# EasyEDA Pro project Thomas' USB Hub.epro

# Schematic Schematic1
Board Name: Board1; Create Date: 2026-05-09; Page Name: P1; Project Name: USB hub; Schematic Name: Schematic1; Update Date: 2026-05-09; Company: EasyEDA.com; Page Size: A4; Version: V1.0
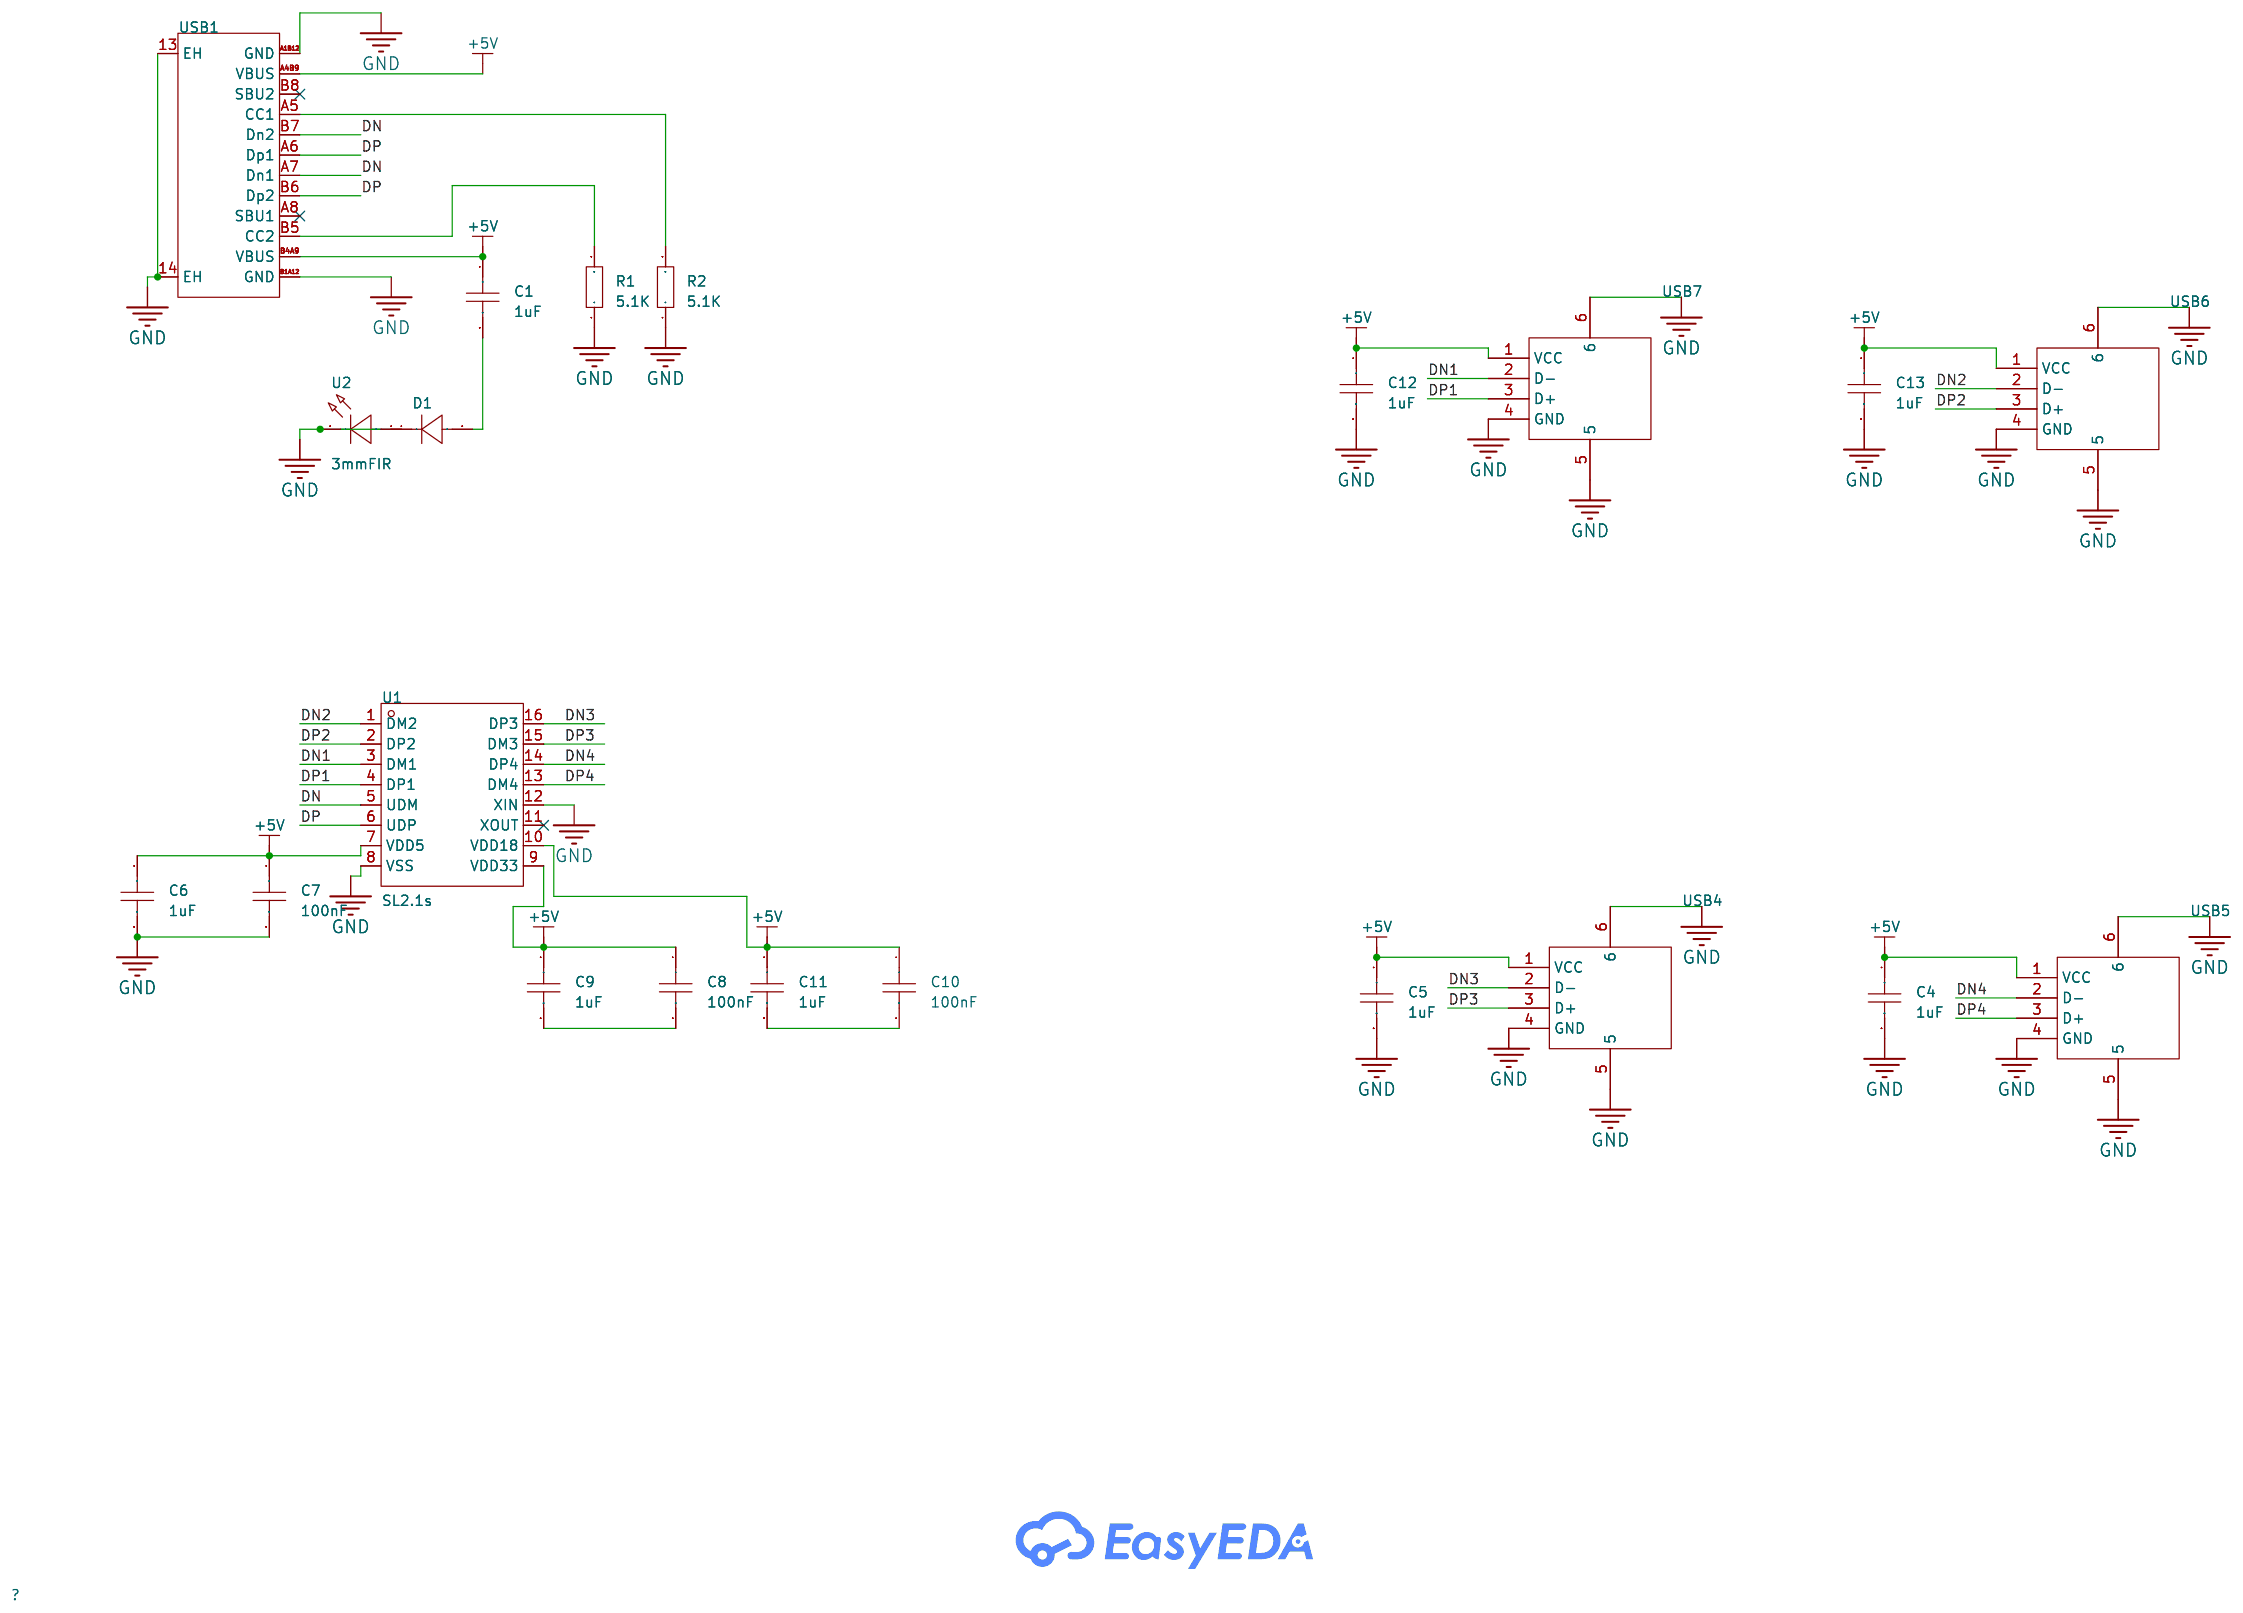
[diagram p0: schematic sheet]

## Parts
C1  1uF  [C0603]
C4  1uF  [C0603]
C5  1uF  [C0603]
C6  1uF  [C0603]
C7  1uF  [C0603]
C8  100nF  [C0603]
C9  1uF  [C0603]
C10  1uF  [C0603]
C11  1uF  [C0603]
C12  1uF  [C0603]
C13  1uF  [C0603]
D1  -  [SMA_L4.4-W2.8-LS5.4-RD]
R1  10K  [R0603]
R2  10K  [R0603]
U1  SL2.1s  [SSOP-16_L4.6-W2.6-P0.53-LS4.0-BL]
U2  3mmFIR  [LED-TH_BD3.0-P2.54-FD]
USB1  TYPE-C 16PIN 2MD(073)  [USB-C-SMD_TYPE-C-16PIN-2MD-073]
USB4  10.0 QHHTZB6.3  [USB-A-TH_10.0QHHTZB6.3]
USB5  10.0 QHHTZB6.3  [USB-A-TH_10.0QHHTZB6.3]
USB6  10.0 QHHTZB6.3  [USB-A-TH_10.0QHHTZB6.3]
USB7  10.0 QHHTZB6.3  [USB-A-TH_10.0QHHTZB6.3]

## Library data of the parts
C1 C4-C13 = CAP_0603: Supplier Footprint: 0603
D1 = 1N4007: Supplier Footprint: SMA(DO-214AC); Supplier Part: C727081
R1 R2 = Res_0603: Supplier Footprint: 0603
U1 = SL2.1s: type:Hub USB Protocol:USB 2.0 Data Rate:- Voltage - Supply:4V~5.25V Voltage - Supply:4V~5.25V Operating Temperature:0℃~+70℃ Operating Temperature:0℃~+70℃ Memory Interface:- Current - Supply:120mA Quiescent Supply Current:2.5mA Number of Channels:4; LCSC Part Name: USB2.0 HUB控制器集成电路; Supplier Part: C2684433; Manufacturer: CoreChips(和芯润德); Supplier Footprint: SSOP-16; JLCPCB Part Class: Extended Part; Datasheet: https://item.szlcsc.com/datasheet/SL2.1s/2782346.html; Supplier: LCSC; type: Hub; USB Protocol: USB 2.0; Voltage - Supply: 4V~5.25V; Operating Temperature: 0℃~+70℃; Current - Supply: 120mA; Quiescent Supply Current: 2.5mA; Number of Channels: 4
U2 = 3mmFIR: Supplier Part: C9900095018; Supplier Footprint: LED-TH_LED-3MM_RED; JLCPCB Part Class: Extended Part; Supplier: LCSC
USB1 = TYPE-C 16PIN 2MD(073): Connector Type:Type-C Protocol Standard:- Gender:Female Mounting Type:Surface Mount, Right Angle Number of Contacts:16P Number of Ports:1 Current Rating-Power:3A Voltage Rating:5V Connect-Disconnect Life:10,000 Cycles Supplementary Features:- Center Heigh; LCSC Part Name: Type-C 母 卧贴; Supplier Part: C2765186; Manufacturer: SHOU HAN(首韩); Supplier Footprint: SMD; JLCPCB Part Class: Extended Part; Datasheet: https://item.szlcsc.com/datasheet/TYPE-C%252016PIN%25202MD(073)/2901843.html; Supplier: LCSC; Connector Type: Type-C; Gender: Female; Mounting Type: Surface Mount, Right Angle; Number of Contacts: 16P; Number of Ports: 1; Current Rating-Power: 3A; Voltage Rating: 5V; Connect-Disconnect Life: 10,000 Cycles; Detection color: Black; Operating Temperature: -25℃~+85℃
USB4-USB7 = 10.0 QHHTZB6.3: Connector Type:Type-A Protocol Standard:USB 2.0 Gender:Female Mounting Type:Surface Mount, Right Angle Number of Contacts:4P Number of Ports:1 Current Rating-Power:1.5A Voltage Rating:30V Connect-Disconnect Life:5,000 times Supplementary Features:- Center; LCSC Part Name: 壳长10.0mm; Supplier Part: C668591; Manufacturer: SHOU HAN(首韩); Supplier Footprint: SMD; JLCPCB Part Class: Extended Part; Datasheet: https://item.szlcsc.com/datasheet/10.0%2520QHHTZB6.3/698534.html; Supplier: LCSC; Connector Type: Type-A; Protocol Standard: USB 2.0; Gender: Female; Mounting Type: Surface Mount, Right Angle; Number of Contacts: 4P; Number of Ports: 1; Current Rating-Power: 1.5A; Voltage Rating: 30V; Connect-Disconnect Life: 5,000 times; Length: 10mm; Detection color: Black; Operating Temperature: -25℃~+85℃

## Nets
+5V: C1.1 C4.1 C5.1 C6.1 C7.1 C8.1 C9.1 C10.1 C11.1 C12.1 C13.1 U1.7(VDD5) U1.9(VDD33) U1.10(VDD18) USB1.A4B9(VBUS) USB1.B4A9(VBUS) USB4.1(VCC) USB5.1(VCC) USB6.1(VCC) USB7.1(VCC)
GND: C4.2 C5.2 C6.2 C7.2 C12.2 C13.2 D1.1(K) R1.1 R2.1 U1.8(VSS) U1.12(XIN) U2.2(K) USB1.13(EH) USB1.14(EH) USB1.A1B12(GND) USB1.B1A12(GND) USB4.4(GND) USB4.5 USB4.6 USB5.4(GND) USB5.5 USB5.6 USB6.4(GND) USB6.5 USB6.6 USB7.4(GND) USB7.5 USB7.6
DN: U1.5(UDM) USB1.A7(Dn1) USB1.B7(Dn2)
DN1: U1.3(DM1) USB7.2(D-)
DN2: U1.1(DM2) USB6.2(D-)
DN3: U1.16(DP3) USB4.2(D-)
DN4: U1.14(DP4) USB5.2(D-)
DP: U1.6(UDP) USB1.A6(Dp1) USB1.B6(Dp2)
DP1: U1.4(DP1) USB7.3(D+)
DP2: U1.2(DP2) USB6.3(D+)
DP3: U1.15(DM3) USB4.3(D+)
DP4: U1.13(DM4) USB5.3(D+)
$1N3638: R2.2 USB1.A5(CC1)
$1N3643: R1.2 USB1.B5(CC2)
$1N4842: C8.2 C9.2
$1N4933: C10.2 C11.2
$1N6861: C1.2 D1.2(A)

Not connected (* = marked no-connect by the designer): U1 11(XOUT)*; U2 1(A); USB1 A8(SBU1)* B8(SBU2)*

# Board PCB1
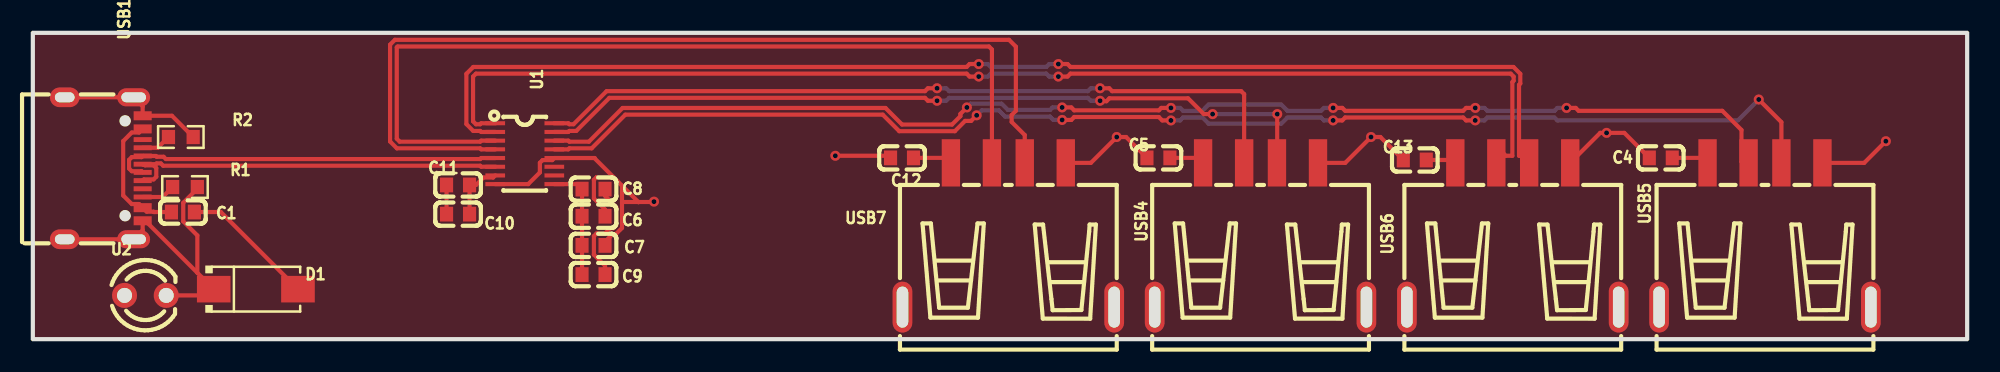
[diagram p1: board, top side]
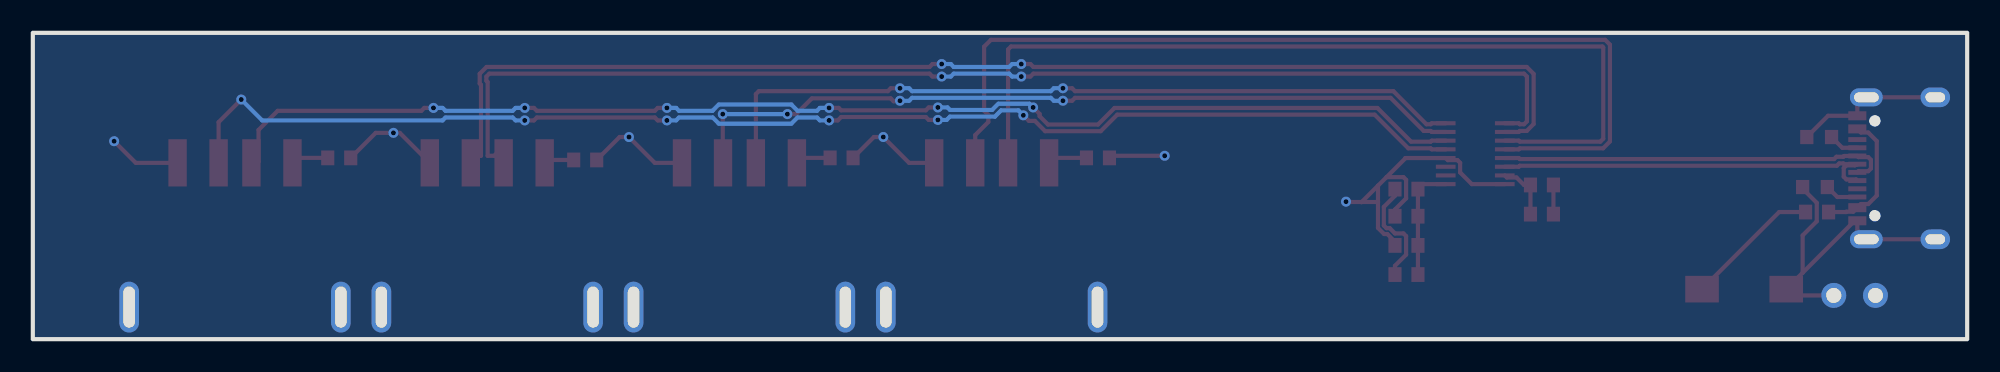
[diagram p2: board, bottom side, seen from below]

Outline 117.86 x 18.67 mm; copper layers: Top Layer, Bottom Layer. Coordinates in mm from the lower left corner of the outline.
Outline path: rectangle 0,18.67 117.86,0
Stack: Top Layer 0.035mm / Dielectric1 1.51mm FR4 er 4.5 / Bottom Layer 0.035mm

## Design rules (mm)
net DN2: DP3
net DP2: DP3
net DN1: DP2
net DP1: DP2
net DN: DP1
net DP: DP1
net DP4: DP5
net DN4: DP5
net DP3: DP4
net DN3: DP4
template: Custom Config
spacing copperThickness1oz (default): track to track 0.102, other pairs 0.152 to 0.3
spacing copperThickness2oz: track to track 0.203, other pairs 0.152 to 0.3
track width copperThickness1oz (default): min 0.127, default 0.254, max 2.54
track width copperThickness2oz: min 0.203, default 0.254, max 2.54
differential pair differentialPair (default): width min 0.127, default 0.254, max 2.54; gap min 0.152, default 0.152
via viaSize (default): diameter min 0.5, default 0.61, max 10; hole min 0.3, default 0.305, max 6.3

## Placement (name value [footprint] x y rotation side)
C1  1uF  [C0603]  9.14 7.75 0 top
C4  1uF  [C0603]  99.19 11.05 180 top
C5  1uF  [C0603]  68.58 11.05 180 top
C6  1uF  [C0603]  34.16 7.49 0 top
C7  1uF  [C0603]  34.16 5.71 0 top
C8  100nF  [C0603]  34.16 9.14 0 top
C9  1uF  [C0603]  34.16 3.94 0 top
C10  1uF  [C0603]  25.91 7.62 180 top
C11  1uF  [C0603]  25.91 9.4 180 top
C12  1uF  [C0603]  52.96 11.05 180 top
C13  1uF  [C0603]  84.2 10.92 180 top
D1  -  [SMA_L4.4-W2.8-LS5.4-RD]  13.59 3.05 0 top
R1  10K  [R0603]  9.27 9.27 180 top
R2  10K  [R0603]  9.02 12.32 180 top
U1  SL2.1s  [SSOP-16_L4.6-W2.6-P0.53-LS4.0-BL]  29.97 11.3 270 top
U2  3mmFIR  [LED-TH_BD3.0-P2.54-FD]  6.86 2.67 0 top
USB1  TYPE-C 16PIN 2MD(073)  [USB-C-SMD_TYPE-C-16PIN-2MD-073]  4.32 10.41 270 top
USB4  10.0 QHHTZB6.3  [USB-A-TH_10.0QHHTZB6.3]  74.8 6.35 0 top
USB5  10.0 QHHTZB6.3  [USB-A-TH_10.0QHHTZB6.3]  105.54 6.35 0 top
USB6  10.0 QHHTZB6.3  [USB-A-TH_10.0QHHTZB6.3]  90.17 6.35 0 top
USB7  10.0 QHHTZB6.3  [USB-A-TH_10.0QHHTZB6.3]  59.44 6.35 0 top

## Footprints (pads in the part's own frame, mm; a bottom-side part is the same pattern mirrored in y, then rotated)
C0603
  rect 0.8x0.9 smd: 1(-0.7,0) 2(0.7,0)
LED-TH_BD3.0-P2.54-FD
  round 1.524 hole 0.914: 1(-1.27,0) 2(1.27,0)
R0603
  rect 0.806x0.864 smd: 1(-0.753,0) 2(0.753,0)
SMA_L4.4-W2.8-LS5.4-RD
  rect 2.046x1.62 smd: 1(-2.566,0) 2(2.566,0)
SSOP-16_L4.6-W2.6-P0.53-LS4.0-BL
  rect 0.25x1.2 smd: 1(-1.855,-1.8) 2(-1.325,-1.8) 3(-0.795,-1.8) 4(-0.265,-1.8) 5(0.265,-1.8) 6(0.795,-1.8) 7(1.325,-1.8) 8(1.855,-1.8) 9(1.855,1.8) 10(1.325,1.8) 11(0.795,1.8) 12(0.265,1.8) 13(-0.265,1.8) 14(-0.795,1.8) 15(-1.325,1.8) 16(-1.855,1.8)
USB-A-TH_10.0QHHTZB6.3
  rect 1.12x2.88 smd: 1(-3.5,4.395) 2(-1,4.395) 3(1,4.395) 4(3.5,4.395)
  oval 1.2x3.1 hole 0.7x2.5: 5(-6.45,-4.395) 6(6.45,-4.395)
USB-C-SMD_TYPE-C-16PIN-2MD-073
  oval 1.1x2 hole 0.6x1.5: 13(-4.325,1.825) 14(4.325,1.825)
  oval 1.2x1.8 hole 0.6x1.2: 13(-4.325,-2.375) 14(4.325,-2.375)
  rect 0.55x1.1 smd: A1B12(-3.2,2.375) A4B9(-2.4,2.375) B1A12(3.2,2.375) B4A9(2.4,2.375)
  rect 0.3x1.1 smd: A5(-1.25,2.375) A6(-0.25,2.375) A7(0.25,2.375) A8(1.25,2.375) B5(1.75,2.375) B6(0.75,2.375) B7(-0.75,2.375) B8(-1.75,2.375)

## Nets
As in the schematic.

Pads without a net: U1 11; U2 1; USB1 A8 B8

## Via types
v1: diameter 0.61, hole 0.305, Top Layer to Bottom Layer, 28 vias

## Routing (per net, layer and track width the routed paths; a pad name or vN(x,y) marks a point on that pad's centre or on a via; arc(x,y) is an arc through that point)
+5V: length 27.4
  Top Layer w0.254: U1.9 33.16,9.45 C8.1 C6.1 C7.1 C9.1 ; USB7.1 55.63,11.05 C12.1 ; USB5.1 101.73,11.05 C4.1 ; C10.1 C11.1 27,9.4 27.46,9.85 28.05,9.85 U1.7 ; USB1.A4B9 6.47,12.59 6.03,12.59 5.51,12.07 5.51,8.75 6.03,8.23 6.47,8.23 USB1.B4A9 6.94,7.77 7.36,7.77 7.38,7.75 C1.1 ; C13.1 86.49,10.92 USB6.1 ; C5.1 71,11.05 USB4.1
GND: length 76
  Top Layer w0.254: USB1.14 6.69,6.64 USB1.B1A12 6.86,7.21 10.02,4.05 ; 35.38,9.87 34.35,9.87 34.18,9.71 34.18,8.58 34.86,7.9 C6.2 ; 35.38,9.87 34.23,11.02 ; 35.38,9.87 35.9,9.35 ; v1(112.9,12.06) 111.58,10.74 USB5.4 ; 34.24,11.04 U1.12 31.65,10.91 31.06,10.91 30.89,10.75 30.89,10.16 30.18,9.45 U1.8 ; 5.57,6.09 USB1.14 ; U2.2 10.64,2.67 D1.1 10.02,4.05 ; USB1.13 6.69,14.19 USB1.A1B12 8.48,13.61 R2.1 ; R1.1 10.02,9.17 9.16,8.31 9.16,7.18 10.02,6.32 10.02,4.05 ; C12.2 52.13,11.18 v1(48.89,11.18) ; v1(37.85,8.38) 37.82,8.36 36.89,8.36 ; C4.2 96.96,12.57 v1(95.89,12.57) 95.5,12.57 USB6.4 ; C7.2 34.86,5.94 35.33,6.41 35.53,6.41 35.9,6.78 35.9,8.36 ; 35.9,9.35 35.9,8.36 ; 35.9,9.35 36.89,8.36 ; 35.9,8.36 36.89,8.36 ; USB7.4 64.47,10.74 v1(66.04,12.32) 66.61,12.32 C5.2 ; 5.57,14.74 USB1.13 ; C13.2 82.1,12.32 v1(81.53,12.32) 79.96,10.74 USB4.4 ; 36.89,8.36 36.91,8.34
DN: length 24
  Top Layer w0.254: USB1.A7 6.62,10.23 6.03,10.23 5.86,10.4 5.86,10.93 6.03,11.09 6.62,11.09 USB1.B7 7.5,11.16 7.54,11.12 7.97,11.12 8.11,10.98 27.26,10.98 27.32,11.04 U1.5
DN1: length 54.9
  Top Layer w0.254: U1.3 27.32,12.1 27.26,12.04 22.35,12.04 22.17,12.22 22.17,17.78 22.23,17.84 58.26,17.84 58.44,17.66 USB7.2
DN2: length 74.3
  Top Layer w0.254: 28.17,13.16 27.32,13.16 27.26,13.1 27,13.1 26.82,13.28 26.82,16 27,16.18 56.9,16.18 57.07,16 v1(57.63,16) ; v1(62.48,16) 63.04,16 63.22,16.18 90.04,16.18 90.22,16 90.22,15.75 90.14,15.67 90.14,11.18 89.74,11.18 89.59,11.33 89.17,10.91 USB6.2
  Bottom Layer w0.254: v1(62.48,16) 61.92,16 61.75,16.18 58.37,16.18 58.19,16 v1(57.63,16)
DN3: length 47.5
  Top Layer w0.254: 31.77,13.16 32.63,13.16 32.69,13.1 32.94,13.1 34.96,15.11 54.36,15.11 54.53,15.29 v1(55.09,15.29) ; v1(65.02,15.29) 65.58,15.29 65.76,15.11 73.62,15.11 73.8,14.93 USB4.2
  Bottom Layer w0.254: v1(55.09,15.29) 55.65,15.29 55.83,15.11 64.29,15.11 64.46,15.29 v1(65.02,15.29)
DN4: length 78.3
  Top Layer w0.254: v1(62.71,14.12) 63.27,14.12 63.45,13.94 68.61,13.94 68.75,14.09 v1(69.34,14.09) ; U1.14 32.63,12.1 32.69,12.04 33.88,12.04 35.93,14.09 51.95,14.09 52.96,13.08 56.01,13.08 56.52,13.59 56.52,13.73 v1(56.91,14.12) ; USB5.2 104.48,10.69 104.23,10.69 104.1,10.82 104.1,12.75 102.94,13.91 94.18,13.91 94.01,14.09 v1(93.45,14.09) ; v1(79.22,14.09) 79.78,14.09 79.96,13.91 87.15,13.91 87.33,14.09 v1(87.88,14.09)
  Bottom Layer w0.254: v1(56.91,14.12) 57.14,14.35 59.03,14.35 59.41,13.97 61.98,13.97 62.13,14.12 v1(62.71,14.12) ; v1(93.45,14.09) 92.89,14.09 92.71,13.91 88.62,13.91 88.44,14.09 v1(87.88,14.09) ; v1(79.22,14.09) 78.66,14.09 78.49,13.91 76.45,13.91 76.06,14.3 71.64,14.3 71.26,13.91 70.08,13.91 69.9,14.09 v1(69.34,14.09)
DP: length 24
  Top Layer w0.254: USB1.B6 6.76,9.73 7.36,9.73 7.52,9.9 7.52,10.43 7.36,10.59 6.84,10.59 6.79,10.64 6.72,10.64 USB1.A6 7.5,10.66 7.54,10.71 7.8,10.71 7.94,10.57 27.26,10.57 27.32,10.51 U1.6
DP1: length 58.4
  Top Layer w0.254: U1.4 27.32,11.57 27.26,11.63 22.18,11.63 21.77,12.05 21.77,17.95 22.06,18.24 59.48,18.24 59.89,17.82 59.89,13.91 59.64,13.66 59.64,13.24 60.44,12.44 USB7.3
DP2: length 75.9
  Top Layer w0.254: USB6.3 91.17,10.91 90.75,11.33 90.6,11.18 90.55,11.18 90.55,15.5 90.63,15.58 90.63,16.17 90.21,16.59 63.22,16.59 63.04,16.77 v1(62.48,16.77) ; U1.2 27.32,12.63 27.26,12.69 26.83,12.69 26.42,13.11 26.42,16.17 26.83,16.59 56.9,16.59 57.07,16.77 v1(57.63,16.77)
  Bottom Layer w0.254: v1(57.63,16.77) 58.19,16.77 58.37,16.59 61.75,16.59 61.92,16.77 v1(62.48,16.77)
DP3: length 48.6
  Top Layer w0.254: v1(55.09,14.53) 54.53,14.53 54.36,14.71 35.13,14.71 33.11,12.69 32.69,12.69 32.63,12.63 U1.15 ; v1(75.82,13.72) 75.82,10.76 USB4.3 ; v1(65.02,14.53) 65.05,14.5 65.41,14.5 65.59,14.68 70.39,14.68 71.35,13.72 v1(71.88,13.72)
  Bottom Layer w0.254: v1(55.09,14.53) 55.65,14.53 55.83,14.71 64.29,14.71 64.46,14.53 v1(65.02,14.53) ; v1(71.88,13.72) v1(75.82,13.72)
DP4: length 81.3
  Top Layer w0.254: v1(69.34,13.33) 68.81,13.33 68.61,13.54 63.45,13.54 63.27,13.36 v1(62.71,13.36) ; v1(79.22,13.33) 79.78,13.33 79.96,13.51 87.15,13.51 87.33,13.33 v1(87.88,13.33) ; U1.13 32.63,11.57 32.69,11.63 34.05,11.63 36.1,13.68 51.78,13.68 52.79,12.67 56.18,12.67 56.8,13.3 57.17,13.3 v1(57.51,13.64) ; v1(105.16,14.6) 106.54,13.22 USB5.3
  Bottom Layer w0.254: v1(87.88,13.33) 88.44,13.33 88.62,13.51 92.71,13.51 92.89,13.33 103.88,13.33 v1(105.16,14.6) ; v1(57.51,13.64) 57.81,13.94 58.86,13.94 59.24,13.56 61.98,13.56 62.18,13.36 v1(62.71,13.36) ; v1(69.34,13.33) 69.9,13.33 70.08,13.51 71.26,13.51 71.64,13.13 76.06,13.13 76.44,13.51 78.49,13.51 78.66,13.33 v1(79.22,13.33)
$1N3638: length 1.8
  Top Layer w0.254: R2.2 7.61,11.66 USB1.A5
$1N3643: length 2.1
  Top Layer w0.254: R1.2 7.91,8.66 USB1.B5
$1N4842: length 6.7
  Top Layer w0.254: C8.2 34.86,8.74 35.54,8.06 35.54,6.93 35.38,6.76 35.18,6.76 34.86,6.44 34.35,6.44 34.18,6.28 34.18,5.15 34.86,4.47 C9.2
$1N4933: length 1.8
  Top Layer w0.254: C11.2 C10.2
$1N6861: length 8.3
  Top Layer w0.254: C1.2 11.46,7.75 D1.2

## Copper pours and planes (outline as drawn; the poured copper is in the pictures)
+5V on Top Layer: -8.76,26.8 130.94,26.8 130.94,-8.13 -8.76,-8.13
GND on Bottom Layer: -9.91,29.46 141.48,29.46 141.48,-15.49 -9.91,-15.49
